# EAGLE schematic SchematicAmplifier (EAGLE 9.3.0)
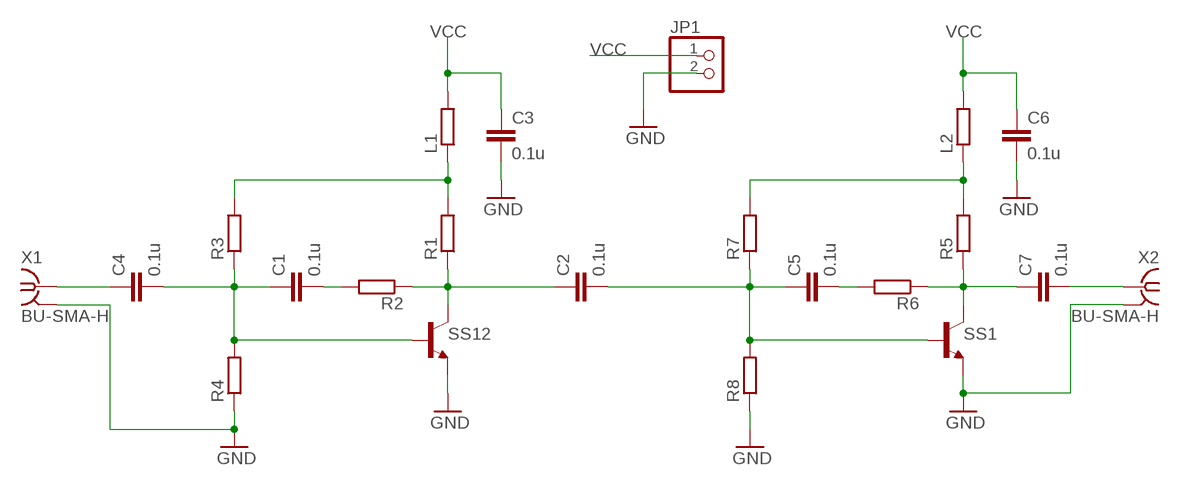
[diagram p0: schematic, sheet 1]

## Parts
C1  0.1u  C-EUC0805  [C0805]
C2  0.1u  C-EUC0805  [C0805]
C3  0.1u  C-EUC0805  [C0805]
C4  0.1u  C-EUC0805  [C0805]
C5  0.1u  C-EUC0805  [C0805]
C6  0.1u  C-EUC0805  [C0805]
C7  0.1u  C-EUC0805  [C0805]
JP1  PINHD-1X2  [1X02]
L1  R-EU_M0805  [M0805]
L2  R-EU_M0805  [M0805]
R1  R-EU_R1206  [R1206]
R2  R-EU_R1206  [R1206]
R3  R-EU_R1206  [R1206]
R4  R-EU_R1206  [R1206]
R5  R-EU_R1206  [R1206]
R6  R-EU_R1206  [R1206]
R7  R-EU_R1206  [R1206]
R8  R-EU_R1206  [R1206]
SS1  -NPN-TO92  [TO92]
SS12  -NPN-TO92  [TO92]
X1  BU-SMA-H  [BU-SMA-H]
X2  BU-SMA-H  [BU-SMA-H]

## Nets
GND: C3.2 C6.2 JP1.2 R4.1 R8.1 SS1.1(E) SS12.1(E) X1.2 X1.3 X1.4 X1.5 X2.2 X2.3 X2.4 X2.5
N$1: C1.2 R2.2
N$2: L1.1 R1.2 R3.2
N$3: C2.1 R1.1 R2.1 SS12.3(C)
N$4: C4.1 X1.1
N$5: C1.1 C4.2 R3.1 R4.2 SS12.2(B)
N$7: L2.1 R5.2 R7.2
N$8: C7.1 R5.1 R6.1 SS1.3(C)
N$9: C2.2 C5.1 R7.1 R8.2 SS1.2(B)
N$10: C5.2 R6.2
N$11: C7.2 X2.1
VCC: C3.1 C6.1 JP1.1 L1.2 L2.2

## Library data of the parts
C1-C7 = rcl:C-EU: CAPACITOR, European symbol; SPICEPREFIX: C
JP1 = pinhead:PINHD-1X2: PIN HEADER
L1 L2 = resistor:R-EU_: RESISTOR, European symbol
R1-R8 = rcl:R-EU_: RESISTOR, European symbol; SPICEPREFIX: R
SS1 SS12 = transistor:*-NPN-: NPN Transistror BF959 corrected 2008.03.06
X1 X2 = con-coax:BU-SMA-H: FEMALE SMA CONNECTOR Radiall; OC_FARNELL: unknown; OC_NEWARK: unknown